# Altium schematic sheet Sheet1.SchDoc
size A4; SheetNumber: 1; SheetTotal: 1
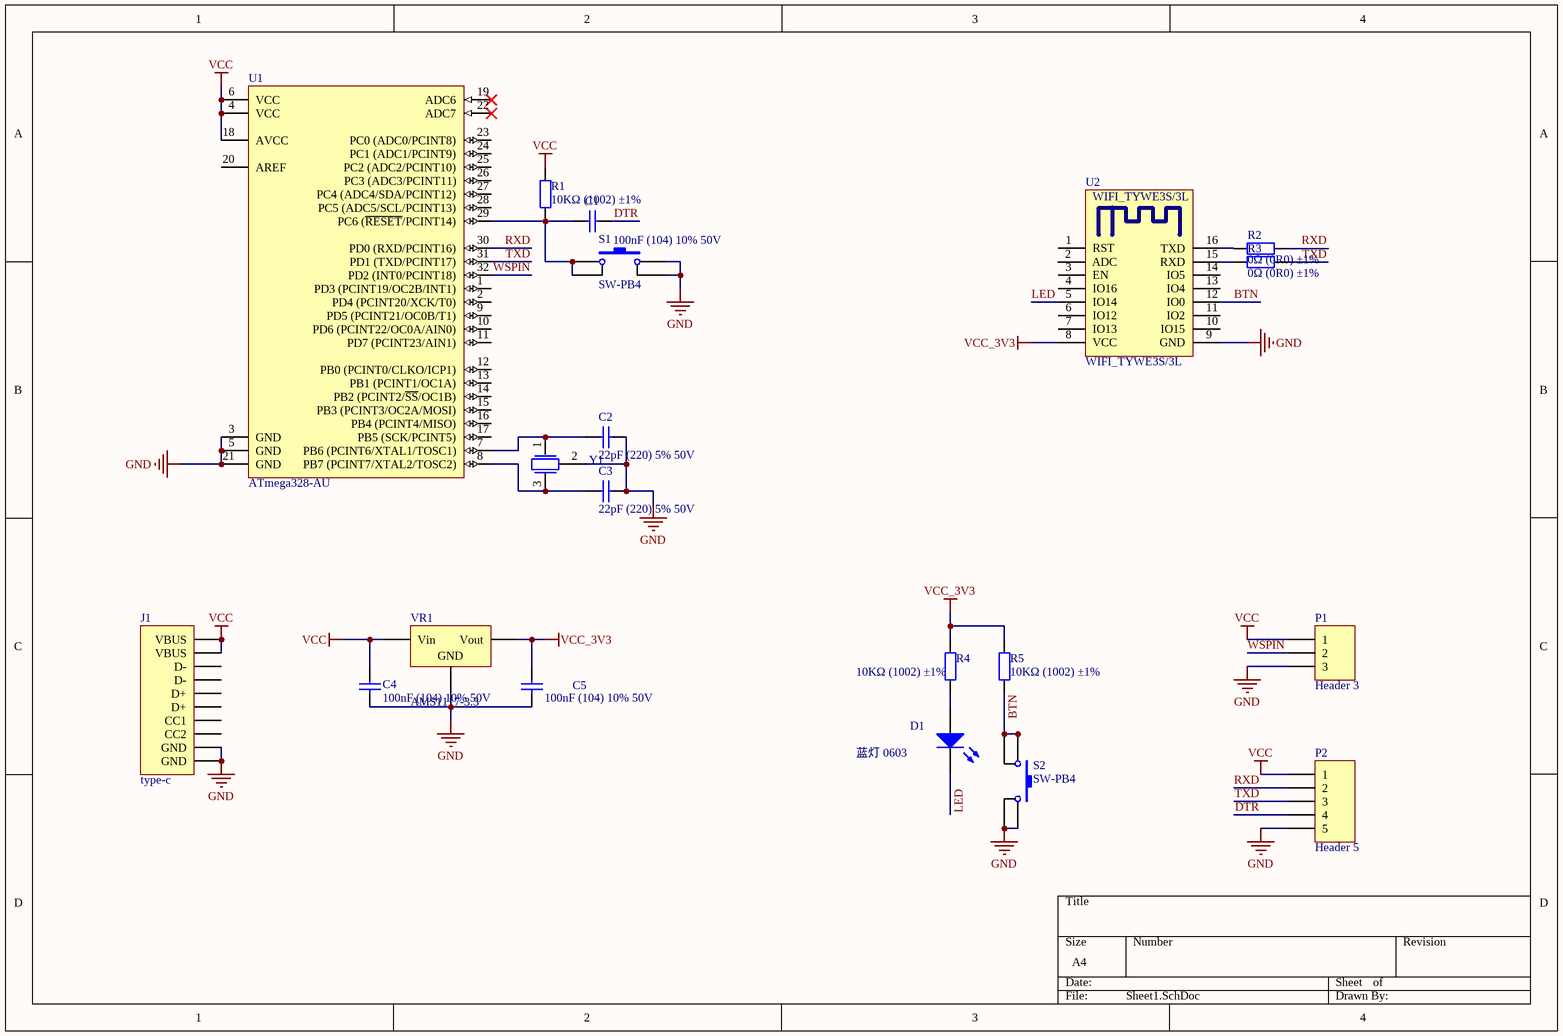
[diagram p0: Sheet1.SchDoc]

## Parts
C1  100nF (104) 10% 50V  [LC-0603_C]
C2  22pF (220) 5% 50V  [LC-0603_C]
C3  22pF (220) 5% 50V  [LC-0603_C]
C4  100nF (104) 10% 50V  [LC-0603_C]
C5  100nF (104) 10% 50V  [LC-0603_C]
D1  蓝灯 0603  [LC-0603_LED_S1]
J1  type-c  [type]
P1  Header 3  [XH2.54 3P]
P2  Header 5  [HDR1X5]
R1  10KΩ (1002) ±1%  [LC-0603_R]
R2  0Ω (0R0) ±1%  [LC-0603_R]
R3  0Ω (0R0) ±1%  [LC-0603_R]
R4  10KΩ (1002) ±1%  [LC-0603_R]
R5  10KΩ (1002) ±1%  [LC-0603_R]
S1  SW-PB4  [SW_PB4_A1]
S2  SW-PB4  [SW_PB4_A1]
U1  ATmega328-AU  [32A_N]
U2  WIFI_TYWE3S/3L  [WIFI_TYWE3S/3L]
VR1  AMS1117-3.3  [LC-SOT-223]
Y1  XTAL-3PIN  [X-CPX20]  (value not drawn)

## Nets
GND: C2.2 C3.2 C4.1 C5.1 J1.A1B12(GND) J1.A12B1(GND) P1.3 P2.5 S1.2 S1.3 S2.2 S2.3 U1.3(GND) U1.5(GND) U1.21(GND) U2.9(GND) VR1.1(GND) Y1.2
VCC: C4.2 J1.A4B9(VBUS) J1.A9B4(VBUS) P1.1 P2.1 R1.2 U1.4(VCC) U1.6(VCC) U1.18(AVCC) VR1.3(Vin)
VCC_3V3: C5.2 R4.1 R5.2 U2.8(VCC) VR1.2(Vout)
BTN: R5.1 S2.1 S2.4 U2.12(IO0)
DTR: C1.1 P2.4
LED: D1.K U2.5(IO14)
RXD: P2.2 R2.2 U1.30(PD0_(RXD/PCINT16))
TXD: P2.3 R3.2 U1.31(PD1_(TXD/PCINT17))
WSPIN: P1.2 U1.32(PD2_(INT0/PCINT18))
NetC1_2: C1.2 R1.1 S1.1 S1.4 U1.29(PC6_(~{RESET}/PCINT14))
NetC2_1: C2.1 U1.7(PB6_(PCINT6/XTAL1/TOSC1)) Y1.1
NetC3_1: C3.1 U1.8(PB7_(PCINT7/XTAL2/TOSC2)) Y1.3
NetD1_A: D1.A R4.2
NetR2_1: R2.1 U2.16(TXD)
NetR3_1: R3.1 U2.15(RXD)

Not connected (* = marked no-connect by the designer): J1 A5(CC1) A6(D+) A7(D-) B5(CC2) B6(D+) B7(D-); U1 1(PD3_(PCINT19/OC2B/INT1)) 2(PD4_(PCINT20/XCK/T0)) 9(PD5_(PCINT21/OC0B/T1)) 10(PD6_(PCINT22/OC0A/AIN0)) 11(PD7_(PCINT23/AIN1)) 12(PB0_(PCINT0/CLKO/ICP1)) 13(PB1_(PCINT1/OC1A)) 14(PB2_(PCINT2/~{SS}/OC1B)) 15(PB3_(PCINT3/OC2A/MOSI)) 16(PB4_(PCINT4/MISO)) 17(PB5_(SCK/PCINT5)) 19(ADC6)* 20(AREF) 22(ADC7)* 23(PC0_(ADC0/PCINT8)) 24(PC1_(ADC1/PCINT9)) 25(PC2_(ADC2/PCINT10)) 26(PC3_(ADC3/PCINT11)) 27(PC4_(ADC4/SDA/PCINT12)) 28(PC5_(ADC5/SCL/PCINT13)); U2 1(RST) 2(ADC) 3(EN) 4(IO16) 6(IO12) 7(IO13) 10(IO15) 11(IO2) 13(IO4) 14(IO5)

## Library data of the parts
C1 C4 C5 = 0603 100nF (104) 10% 50V: 贴片电容; ComponentLink1Description: 供应商链接; ComponentLink1URL: http://www.szlcsc.com/product/details_15331.html; Package: 0603; Supplier: LC; SuppliersPartNumber: C14663
C2 C3 = 0603 22pF (220) 5% 50V: 贴片电容; ComponentLink1Description: 供应商链接; ComponentLink1URL: http://www.szlcsc.com/product/details_2005.html; Package: 0603; Supplier: LC; SuppliersPartNumber: C1653
D1 = 0603 蓝灯: 发光二极管; ComponentLink1Description: 供应商链接; ComponentLink1URL: http://www.szlcsc.com/product/details_73150.html; Package: 0603; Supplier: LC; SuppliersPartNumber: C72041
P1 = Header 3: Header, 3-Pin; LatestRevisionDate: 17-Jul-2002; LatestRevisionNote: Re-released for DXP Platform.; Publisher: Altium Limited
P2 = Header 5: Header, 5-Pin; LatestRevisionDate: 17-Jul-2002; LatestRevisionNote: Re-released for DXP Platform.; Publisher: Altium Limited
R1 R4 R5 = 0603 10KΩ (1002) 1%: 贴片电阻; ComponentLink1Description: 供应商链接; ComponentLink1URL: http://www.szlcsc.com/product/details_26547.html; Package: 0603; Supplier: LC; SuppliersPartNumber: C25804
R2 R3 = 0603 0Ω (0R0) 1%: 贴片电阻; ComponentLink1Description: 供应商链接; ComponentLink1URL: http://www.szlcsc.com/product/details_21903.html; Package: 0603; Supplier: LC; SuppliersPartNumber: C21189
S1 S2 = SW-PB4: 微动开关; Published: 24-Mar-1999; LatestRevisionDate: 17-Jul-2002; LatestRevisionNote: Re-released for DXP Platform.; PackageReference: SPST-2; Publisher: Altium Limited
U1 = ATmega328-AU: 8-bit AVR Microcontroller, 32KB Flash, 1KB EEPROM, 2KB SRAM, 32-pin TQFP, Industrial Grade (-40癈 to 85癈); Published: 1-Apr-2010; DatasheetVersion: revA, Jan-2010; PackageVersion: revB, Oct-2001; PackageReference: 32A; Publisher: Altium Limited; PackageDescription: 32-Lead, 7x7x1.0 mm Body, 0.8mm Lead Pitch, Thin Profile Plastic Quad Flat Package (TQFP); Supplier 1: Digi-Key; Supplier Part Number 1: ATMEGA328-AU-ND; Supplier 2: Mouser; Supplier Part Number 2: 556-ATMEGA328-AU; Code_JEDEC: MS-026-ABA; ComponentLink1Description: Manufacturer Link; ComponentLink1URL: http://www.atmel.com/products/avr/default.asp?; ComponentLink2Description: ATmega48A/48PA/88A/88PA/168A/168PA/328/328P Datasheet; ComponentLink2URL: http://www.atmel.com/dyn/resources/prod_documents/8271.pdf; ComponentLink3Description: ATmega48A/48PA/88A/88PA/168A/168PA/328/328P Summary; ComponentLink3URL: http://www.atmel.com/dyn/resources/prod_documents/8271S.pdf; ComponentLink4Description: Atmel.com Home; ComponentLink4URL: http://www.atmel.com
U2 = WIFI_TYWE3S/3L: Module
VR1 = SOT-223 AMS1117-3.3: 低压差线性稳压(LDO); ComponentLink1Description: 供应商链接; ComponentLink1URL: http://www.szlcsc.com/product/details_6652.html; Package: SOT-223; Supplier: LC; SuppliersPartNumber: C6186
Y1 = XTAL-3PIN: 贴片晶振